# EAGLE design BYOG_Shield (EAGLE 7.2.0)
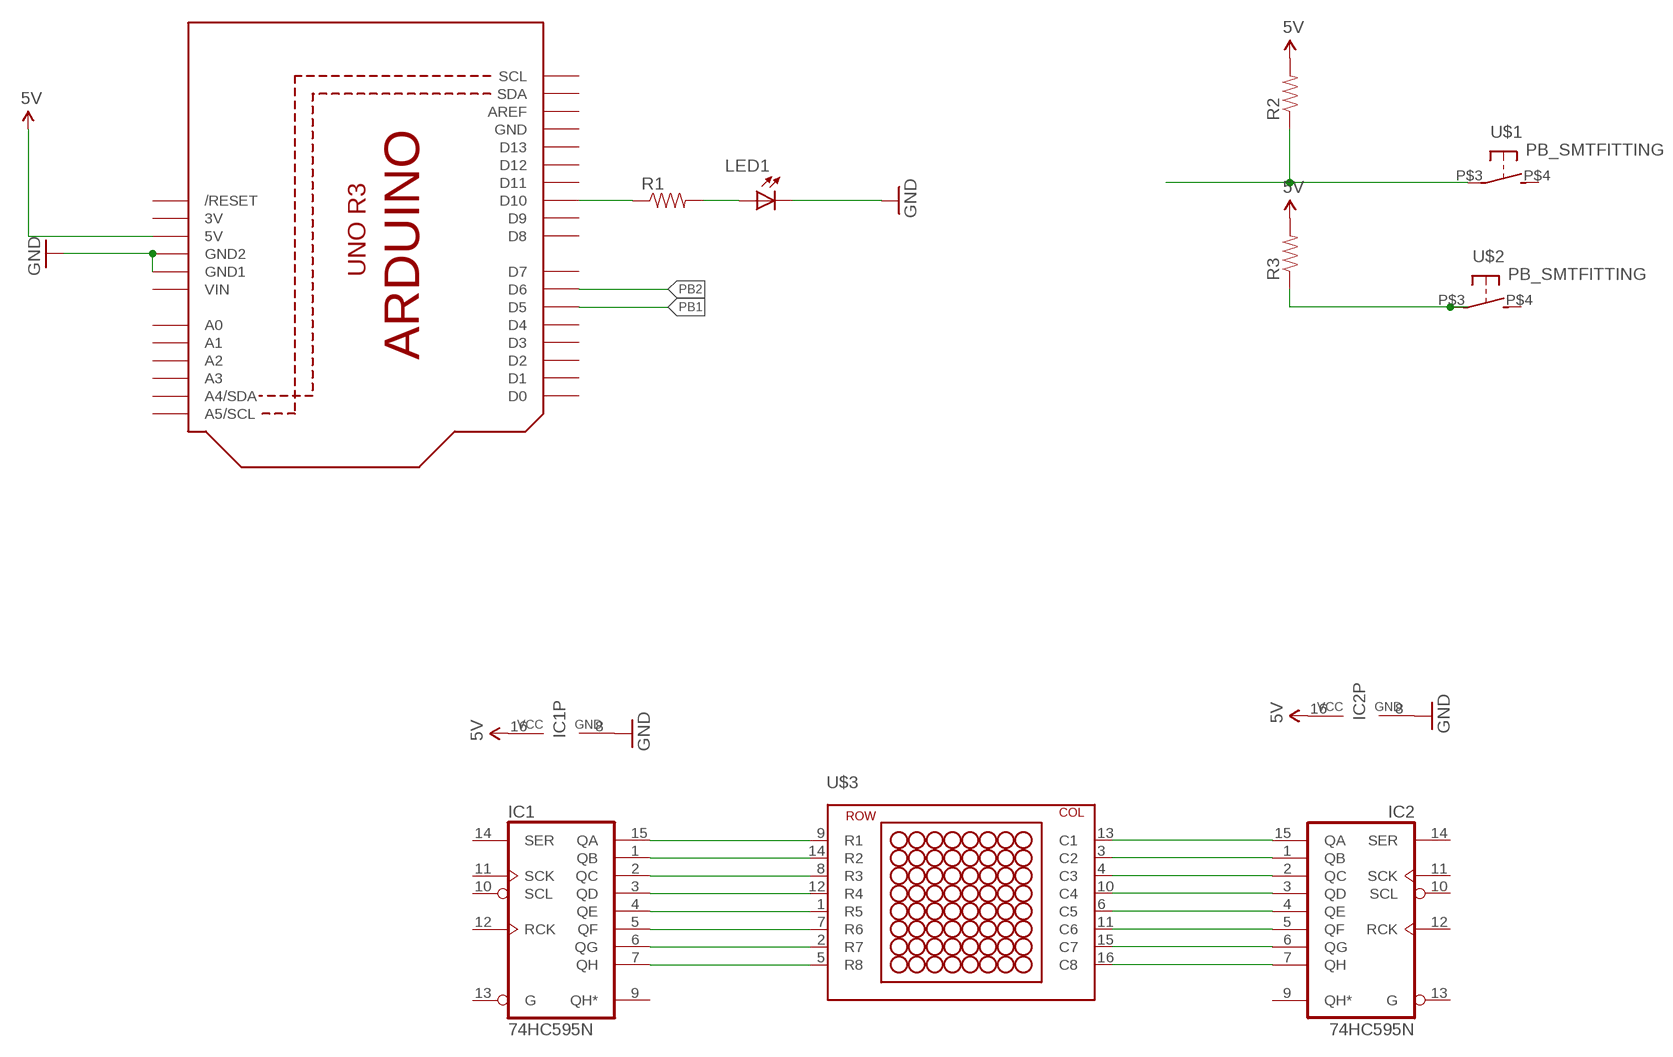
[diagram p0: schematic, sheet 1]

## Parts
IC1  74HC595N  [DIL16]
IC2  74HC595N  [DIL16]
LED1  LED/0805  [CHIP-LED0805]
R1  RESISTOR0805-RES  [0805]
R2  RESISTOR0805-RES  [0805]
R3  RESISTOR0805-RES  [0805]
U1  ARDUINOR3-NOIOREF-NOTEXT  [ARDUINOR3-NOTEXT-NOIOREF]
U$1  PB_SMTFITTING  [PB_SMT_TIGHT]
U$2  PB_SMTFITTING  [PB_SMT_TIGHT]
U$3  8X8DM_2088AS  [8X8DM_2088AS]

## Nets
5V: IC1.16(VCC) IC2.16(VCC) R2.2 R3.2 U1.5V
GND: IC1.8(GND) IC2.8(GND) LED1.C U1.GND1 U1.GND2
N$1: R1.1 U1.D10
N$5: LED1.A R1.2
N$6: R2.1 U$1.P$3
N$7: R3.1 U$2.P$3
N$8: IC1.1(QB) U$3.14(R2)
N$9: IC1.2(QC) U$3.8(R3)
N$10: IC1.3(QD) U$3.12(R4)
N$11: IC1.4(QE) U$3.1(R5)
N$12: IC1.5(QF) U$3.7(R6)
N$13: IC1.6(QG) U$3.2(R7)
N$14: IC1.7(QH) U$3.5(R8)
N$15: IC1.15(QA) U$3.9(R1)
N$16: IC2.1(QB) U$3.3(C2)
N$17: IC2.2(QC) U$3.4(C3)
N$18: IC2.3(QD) U$3.10(C4)
N$19: IC2.4(QE) U$3.6(C5)
N$20: IC2.5(QF) U$3.11(C6)
N$21: IC2.6(QG) U$3.15(C7)
N$22: IC2.7(QH) U$3.16(C8)
N$23: IC2.15(QA) U$3.13(C1)
PB1: U1.D5
PB2: U1.D6
Unconnected: IC1.9(QH*) IC1.10(SCL) IC1.11(SCK) IC1.12(RCK) IC1.13(G) IC1.14(SER) IC2.9(QH*) IC2.10(SCL) IC2.11(SCK) IC2.12(RCK) IC2.13(G) IC2.14(SER) U1.A0 U1.A1 U1.A2 U1.A3 U1.A4(A4/SDA) U1.A5(A5/SCL) U1.AREF U1.D0 U1.D1 U1.D2 U1.D3 U1.D4 U1.D7 U1.D8 U1.D9 U1.D11 U1.D12 U1.D13 U1.RESET(/RESET) U1.SCL U1.SDA U$1.P$4 U$2.P$4

## Power pins joined to a net without a drawn wire
3V: U1.3V
GND: U1.GND
VIN: U1.VIN

## Library data of the parts
IC1 IC2 = AISCube_BYOG:74*595: 8-bit SHIFT REGISTER, output latch
LED1 = AISCube_BYOG:LED: LED
R1-R3 = AISCube_BYOG:RESISTOR: Resistor Basic schematic elements and footprints for 0603, 1206, and PTH resistors.
U1 = adafruit:ARDUINOR3-NOIOREF
U$1 U$2 = AISCube_BYOG:PB_SMT: Low profile SMT pushbutton Used as reset & user buttons
U$3 = AISCube_BYOG:8X8DM_2088AS

## Board
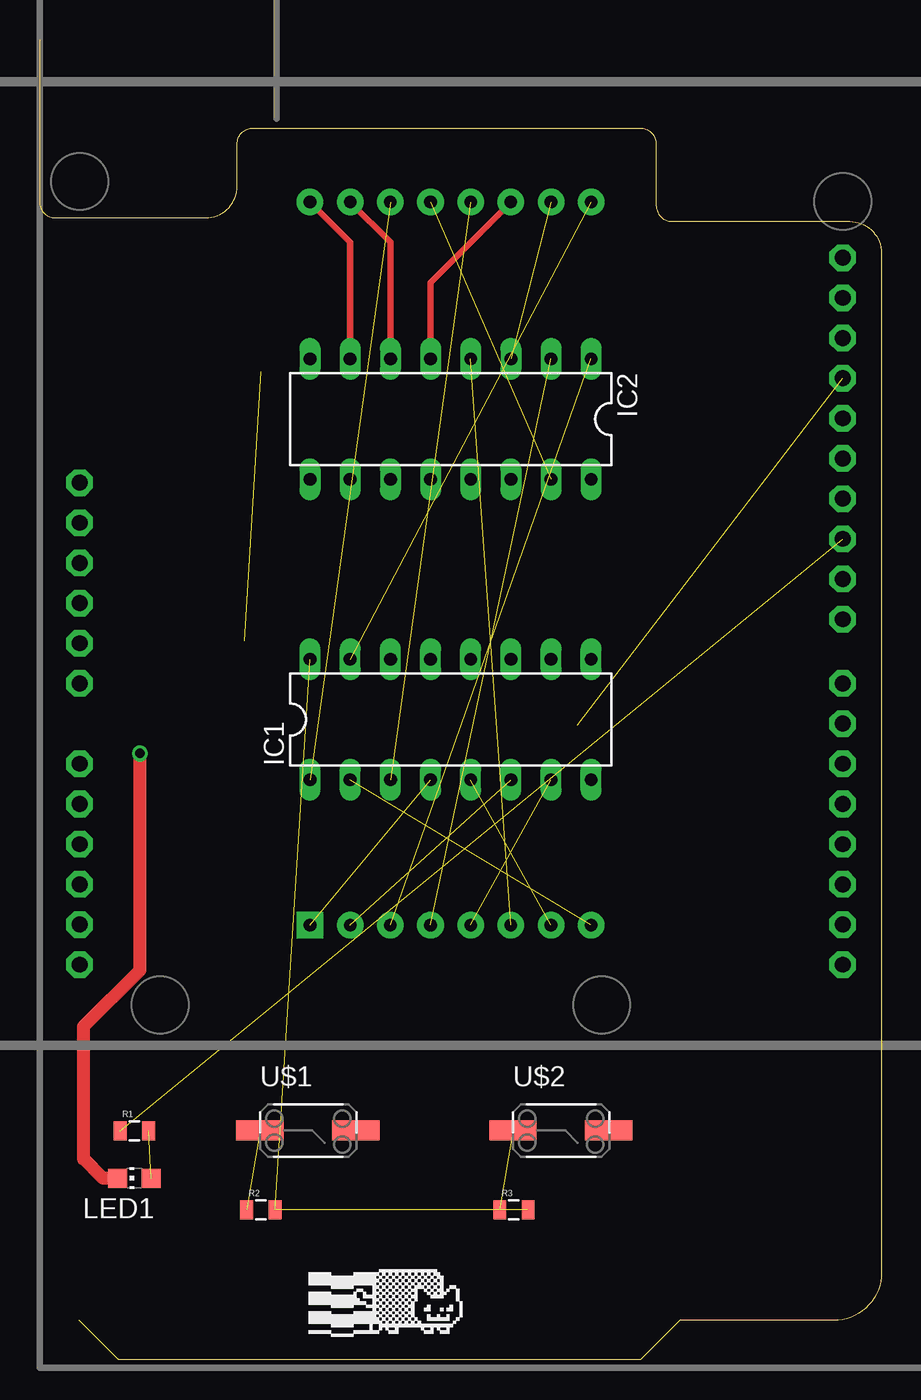
[diagram p1: board, top side]
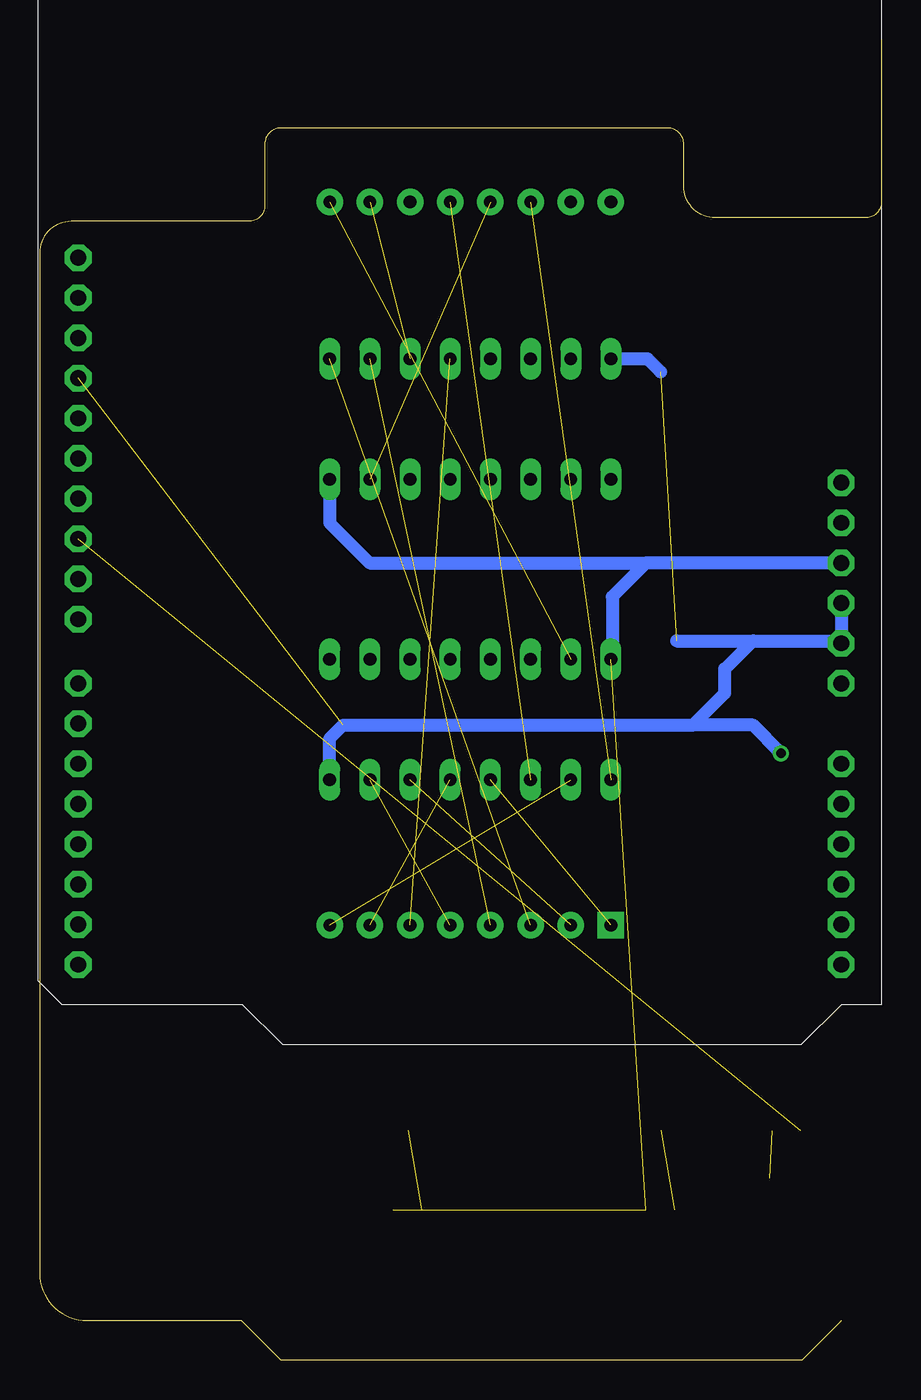
[diagram p2: board, bottom side, seen from below]

Size 53.25 x 83.5 mm. Coordinates in mm from the lower left corner, seen from the top.
Outline: 0,83.5 0,73.22 arc90 1,72.22 10.5,72.22 arc90 12.5,74.22 12.5,76.9 arc-90 13.5,77.9 38,77.9 arc-90 39,76.9 39,73 arc90 40,72 51.25,72 arc-90 53.25,70 53.25,5.5 arc-90 50.25,2.5 40.5,2.5 38,0 5,0 2.5,2.5
Copper layers (1*16): Top 0.0356mm / dielectric 1.5011mm / Bottom 0.0356mm
Design rules "AISCube": minimum track width 7mil, minimum drill 14mil, track to track 7mil, track to pad 7mil, pad to pad 7mil, via to via 7mil, smd to smd 0mil, copper to edge 20mil, drill to drill 8mil, minimum pad ring 10mil, minimum via ring 8mil, stop-mask expansion 4mil, vias tented up to drill 32mil, thermal gap 10mil

### Footprints (pad centres in the part's own frame; a part is rotated, then mirrored left to right if it is on the bottom)
DIL16 = drill 0.813 long: 1 -8.89,-3.81; 2 -6.35,-3.81; 3 -3.81,-3.81; 4 -1.27,-3.81; 5 1.27,-3.81; 6 3.81,-3.81; 7 6.35,-3.81; 8 8.89,-3.81; 9 8.89,3.81; 10 6.35,3.81; 11 3.81,3.81; 12 1.27,3.81; 13 -1.27,3.81; 14 -3.81,3.81; 15 -6.35,3.81; 16 -8.89,3.81
CHIP-LED0805 = smd 1.2 x 1.2: A 0,-1.05; C 0,1.05
0805 = smd 0.8 x 1.2: 1 -0.9,0; 2 0.9,0
ARDUINOR3-NOTEXT-NOIOREF = drill 1 pad 1.676 octagon: 3V 35.56,2.54; 5V 38.1,2.54; A0 50.8,2.54; A1 53.34,2.54; A2 55.88,2.54; A3 58.42,2.54; A4 60.96,2.54; A5 63.5,2.54; AREF 23.876,50.8; D0 63.5,50.8; D1 60.96,50.8; D2 58.42,50.8; D3 55.88,50.8; D4 53.34,50.8; D5 50.8,50.8; D6 48.26,50.8; D7 45.72,50.8; D8 41.656,50.8; D9 39.116,50.8; D10 36.576,50.8; D11 34.036,50.8; D12 31.496,50.8; D13 28.956,50.8; GND 26.416,50.8; GND1 43.18,2.54; GND2 40.64,2.54; RESET 33.02,2.54; SCL 18.796,50.8; SDA 21.336,50.8; VIN 45.72,2.54
PB_SMT_TIGHT = smd 3 x 1.27: P$3 -3.056,0.008; P$4 3.01,0.008
8X8DM_2088AS = drill 0.8 pad 1.676 square: 1 -8.89,0 | drill 0.8 pad 1.676: 2 -6.35,0; 3 -3.81,0; 4 -1.27,0; 5 1.27,0; 6 3.81,0; 7 6.35,0; 8 8.89,0; 9 8.89,45.72; 10 6.35,45.72; 11 3.81,45.72; 12 1.27,45.72; 13 -1.27,45.72; 14 -3.81,45.72; 15 -6.35,45.72; 16 -8.89,45.72

### Placement (x,y rotation side)
IC1  26,40.5 0 top
IC2  26,59.5 180 top
LED1  6,11.5 90 top
R1  6,14.5 0 top
R2  14,9.5 0 top
R3  30,9.5 0 top
U1  0,88.5 270 top
U$1  17,14.5 0 top
U$2  33,14.5 0 top
U$3  26,27.5 0 top
U$8  [LOGO_NYAN]  17.02,-2.79 0 top

### Tracks (layer width: path | path; a pad name or v marks a point on that pad's centre or on a via)
5V  (2 unrouted)
  Bottom 0.813: U1.5V 12.19,50.4 14.89,50.4 | 14.89,50.4 17.02,48.27 17.02,44.4 IC1.16 | IC2.16 34.89,52.93 32.36,50.4 14.89,50.4
GND  (via drill 0.6)  (2 unrouted)
  Top 0.813: LED1.C 4,11.5 2.79,12.71 2.79,21.09 6.35,24.65 v6.35,38.36
  Bottom 0.813: U1.GND2 U1.GND1 2.69,45.47 8.13,45.47 | IC1.8 34.89,39.29 34.04,40.14 12.95,40.14 11.94,40.14 | 11.94,40.14 9.91,42.17 9.91,43.7 8.13,45.47 | IC2.8 14.79,63.31 13.97,62.49 | 12.95,45.47 8.13,45.47 | v6.35,38.36 8.13,40.14 11.94,40.14
N$1  (1 unrouted)
N$5  (1 unrouted)
N$6  (1 unrouted)
N$7  (1 unrouted)
N$8  (1 unrouted)
N$9  (1 unrouted)
N$10  (1 unrouted)
N$11  (1 unrouted)
N$12  (1 unrouted)
N$13  (1 unrouted)
N$14  (1 unrouted)
N$15  (1 unrouted)
N$16  (1 unrouted)
N$17  (1 unrouted)
N$18  (1 unrouted)
N$19  (1 unrouted)
N$20
  Top 0.406: IC2.5 24.73,68.14 U$3.11
N$21
  Top 0.406: U$3.15 22.19,70.68 IC2.6
N$22
  Top 0.406: U$3.16 19.65,70.68 IC2.7
N$23  (1 unrouted)